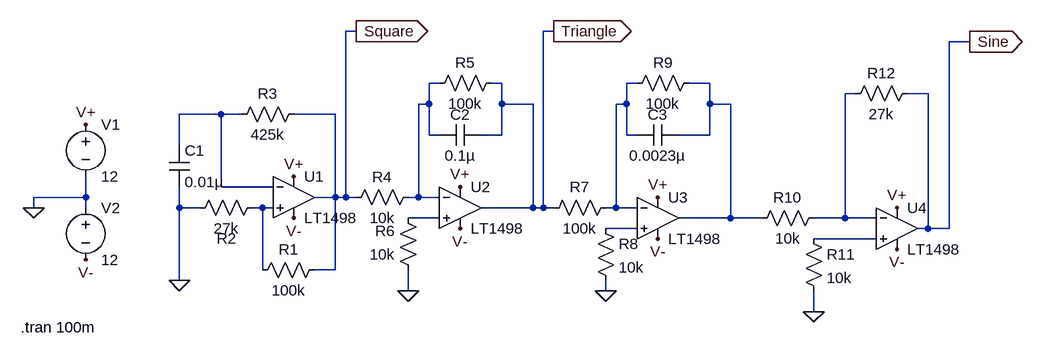
[diagram p0: schematic Final_Circuit.asc]
Final_Circuit.asc, the LTspice schematic file:
Version 4
SHEET 1 1276 680
WIRE 224 -80 208 -80
WIRE 528 -80 512 -80
WIRE 1168 -64 1136 -64
WIRE 352 0 336 0
WIRE 448 0 432 0
WIRE 656 0 640 0
WIRE 768 0 736 0
WIRE 992 16 976 16
WIRE 1104 16 1072 16
WIRE 336 32 336 0
WIRE 336 32 320 32
WIRE 448 32 448 0
WIRE 496 32 448 32
WIRE 640 32 640 0
WIRE 640 32 624 32
WIRE 768 32 768 0
WIRE 800 32 768 32
WIRE 16 48 -48 48
WIRE 48 48 16 48
WIRE 192 48 128 48
WIRE 336 80 336 32
WIRE 352 80 336 80
WIRE 448 80 448 32
WIRE 448 80 416 80
WIRE 640 80 640 32
WIRE 656 80 640 80
WIRE 768 80 768 32
WIRE 768 80 720 80
WIRE -48 96 -48 48
WIRE 16 160 16 48
WIRE 96 160 16 160
WIRE -192 176 -192 144
WIRE -192 176 -272 176
WIRE 192 176 192 48
WIRE 192 176 160 176
WIRE 208 176 208 -80
WIRE 208 176 192 176
WIRE 224 176 208 176
WIRE 320 176 320 32
WIRE 320 176 304 176
WIRE 352 176 320 176
WIRE -272 192 -272 176
WIRE -192 192 -192 176
WIRE -48 192 -48 160
WIRE -16 192 -48 192
WIRE 80 192 64 192
WIRE 96 192 80 192
WIRE 496 192 496 32
WIRE 496 192 416 192
WIRE 512 192 512 -80
WIRE 512 192 496 192
WIRE 528 192 512 192
WIRE 624 192 624 32
WIRE 624 192 608 192
WIRE 656 192 624 192
WIRE 352 208 304 208
WIRE 800 208 800 32
WIRE 800 208 720 208
WIRE 848 208 800 208
WIRE 976 208 976 16
WIRE 976 208 928 208
WIRE 1024 208 976 208
WIRE 656 224 608 224
WIRE 1104 224 1104 16
WIRE 1104 224 1088 224
WIRE 1136 224 1136 -64
WIRE 1136 224 1104 224
WIRE 1024 240 928 240
WIRE 80 288 80 192
WIRE 192 288 192 176
WIRE 192 288 160 288
WIRE -48 304 -48 192
WIRE 304 320 304 288
WIRE 608 320 608 304
WIRE 928 352 928 320
FLAG -48 304 0
FLAG -272 192 0
FLAG -192 64 V+
FLAG 128 144 V+
FLAG -192 272 V-
FLAG 128 208 V-
FLAG 304 320 0
FLAG 608 320 0
FLAG 928 352 0
FLAG 384 160 V+
FLAG 688 176 V+
FLAG 1056 192 V+
FLAG 384 224 V-
FLAG 688 240 V-
FLAG 1056 256 V-
FLAG 224 -80 Square
IOPIN 224 -80 Out
FLAG 528 -80 Triangle
IOPIN 528 -80 Out
FLAG 1168 -64 Sine
IOPIN 1168 -64 Out
SYMBOL OpAmps\\LT1498 128 112 R0
SYMATTR InstName U1
SYMBOL res 176 272 R90
WINDOW 0 0 56 VBottom 2
WINDOW 3 32 56 VTop 2
SYMATTR InstName R1
SYMATTR Value 100k
SYMBOL res 80 176 R90
WINDOW 0 79 55 VBottom 2
WINDOW 3 32 56 VTop 2
SYMATTR InstName R2
SYMATTR Value 27k
SYMBOL cap -64 96 R0
SYMATTR InstName C1
SYMATTR Value 0.01µ
SYMBOL res 144 32 R90
WINDOW 0 0 56 VBottom 2
WINDOW 3 32 56 VTop 2
SYMATTR InstName R3
SYMATTR Value 425k
SYMBOL voltage -192 48 R0
WINDOW 123 0 0 Left 0
WINDOW 39 0 0 Left 0
SYMATTR InstName V1
SYMATTR Value 12
SYMBOL voltage -192 176 R0
WINDOW 123 0 0 Left 0
WINDOW 39 0 0 Left 0
SYMATTR InstName V2
SYMATTR Value 12
SYMBOL res 320 160 R90
WINDOW 0 0 56 VBottom 2
WINDOW 3 32 56 VTop 2
SYMATTR InstName R4
SYMATTR Value 10k
SYMBOL OpAmps\\LT1498 384 128 R0
SYMATTR InstName U2
SYMBOL res 448 -16 R90
WINDOW 0 0 56 VBottom 2
WINDOW 3 32 56 VTop 2
SYMATTR InstName R5
SYMATTR Value 100k
SYMBOL cap 416 64 R90
WINDOW 0 0 32 VBottom 2
WINDOW 3 32 32 VTop 2
SYMATTR InstName C2
SYMATTR Value 0.1µ
SYMBOL res 320 304 R180
WINDOW 0 36 76 Left 2
WINDOW 3 36 40 Left 2
SYMATTR InstName R6
SYMATTR Value 10k
SYMBOL res 624 176 R90
WINDOW 0 0 56 VBottom 2
WINDOW 3 32 56 VTop 2
SYMATTR InstName R7
SYMATTR Value 100k
SYMBOL OpAmps\\LT1498 688 144 R0
SYMATTR InstName U3
SYMBOL res 592 208 R0
SYMATTR InstName R8
SYMATTR Value 10k
SYMBOL res 752 -16 R90
WINDOW 0 0 56 VBottom 2
WINDOW 3 32 56 VTop 2
SYMATTR InstName R9
SYMATTR Value 100k
SYMBOL cap 720 64 R90
WINDOW 0 0 32 VBottom 2
WINDOW 3 32 32 VTop 2
SYMATTR InstName C3
SYMATTR Value 0.0023µ
SYMBOL res 944 192 R90
WINDOW 0 0 56 VBottom 2
WINDOW 3 32 56 VTop 2
SYMATTR InstName R10
SYMATTR Value 10k
SYMBOL OpAmps\\LT1498 1056 160 R0
SYMATTR InstName U4
SYMBOL res 912 224 R0
SYMATTR InstName R11
SYMATTR Value 10k
SYMBOL res 1088 0 R90
WINDOW 0 0 56 VBottom 2
WINDOW 3 32 56 VTop 2
SYMATTR InstName R12
SYMATTR Value 27k
TEXT -292 376 Left 2 !.tran 100m

The netlist it stands for:
* Final_Circuit.asc
XU1 N006 N005 V+ V- Square LT1498  ; pins In+ In- V+ V- OUT
R1 Square N006 100k
R2 N006 0 27k
C1 N005 0 0.01µ
R3 Square N005 425k
V1 V+ 0 12
V2 0 V- 12
R4 N001 Square 10k
XU2 N007 N001 V+ V- Triangle LT1498  ; pins In+ In- V+ V- OUT
R5 Triangle N001 100k
C2 Triangle N001 0.1µ
R6 0 N007 10k
R7 N002 Triangle 100k
XU3 N008 N002 V+ V- N003 LT1498  ; pins In+ In- V+ V- OUT
R8 N008 0 10k
R9 N003 N002 100k
C3 N003 N002 0.0023µ
R10 N004 N003 10k
XU4 N009 N004 V+ V- Sine LT1498  ; pins In+ In- V+ V- OUT
R11 N009 0 10k
R12 Sine N004 27k
.tran 100m
.lib LTC.lib
.backanno
.end